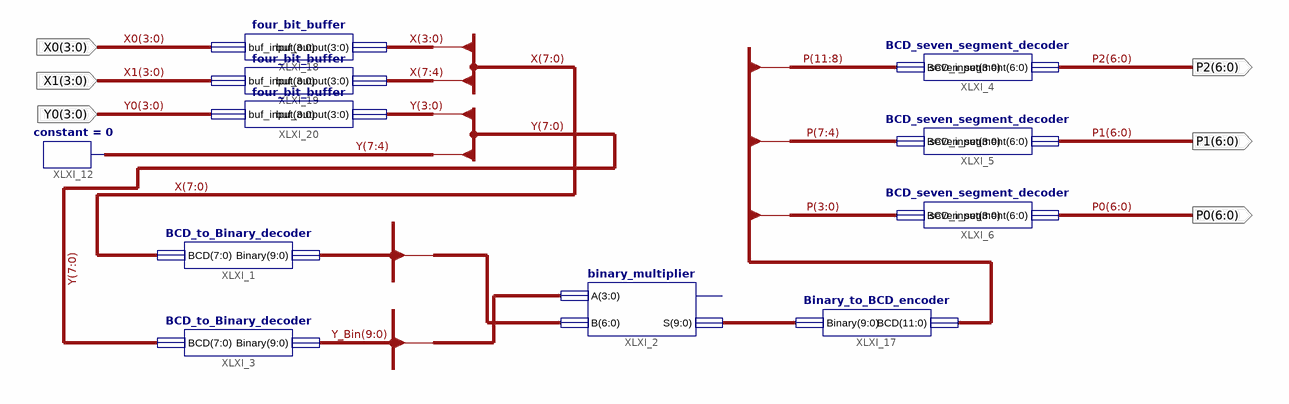
[diagram p0: schematic sheet 1]
// Xilinx ISE schematic BCD_multiplier.sch (artix7) as structural Verilog: 11 symbols, 6 ports
module BCD_multiplier (
  input  [3:0] X0,
  input  [3:0] X1,
  input  [3:0] Y0,
  output [6:0] P2,
  output [6:0] P1,
  output [6:0] P0
);

  wire [7:0] X, Y;
  wire [9:0] X_Bin, XLXN_21, Y_Bin;
  wire [11:0] P;

  binary_multiplier XLXI_2 (.A(Y_Bin[3:0]), .B(X_Bin[6:0]), .S(XLXN_21));  // open: C_out
  BCD_to_Binary_decoder XLXI_3 (.BCD(Y), .Binary(Y_Bin));
  constant #(.CValue("0")) XLXI_12 (.O(Y[7:4]));
  BCD_seven_segment_decoder XLXI_6 (.BCD_input(P[3:0]), .seven_segment(P0));
  BCD_seven_segment_decoder XLXI_5 (.BCD_input(P[7:4]), .seven_segment(P1));
  BCD_seven_segment_decoder XLXI_4 (.BCD_input(P[11:8]), .seven_segment(P2));
  Binary_to_BCD_encoder XLXI_17 (.BCD(P), .Binary(XLXN_21));
  four_bit_buffer XLXI_18 (.buf_input(X0), .buf_output(X[3:0]));
  four_bit_buffer XLXI_19 (.buf_input(X1), .buf_output(X[7:4]));
  four_bit_buffer XLXI_20 (.buf_input(Y0), .buf_output(Y[3:0]));
  BCD_to_Binary_decoder XLXI_1 (.BCD(X), .Binary(X_Bin));
endmodule
